# EAGLE design ESP32_modul (EAGLE 9.3.0)
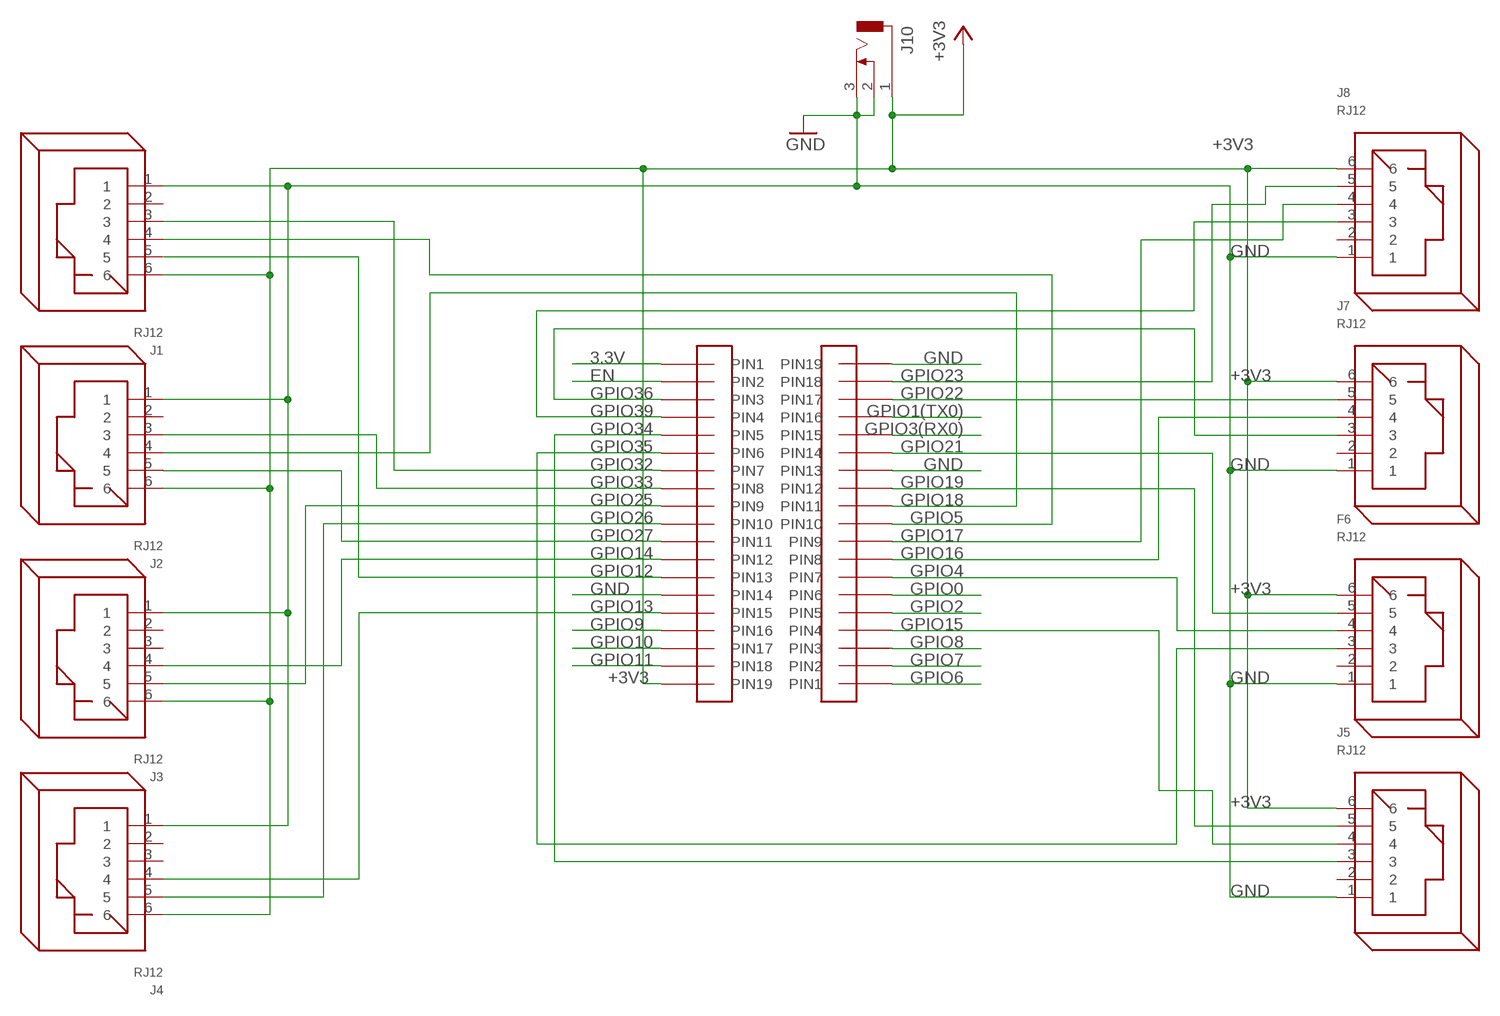
[diagram p0: schematic, sheet 1]

## Parts
F6  RJ12  [RJ12]
J1  RJ12  [RJ12]
J2  RJ12  [RJ12]
J3  RJ12  [RJ12]
J4  RJ12  [RJ12]
J5  RJ12  [RJ12]
J7  RJ12  [RJ12]
J8  RJ12  [RJ12]
J10  DCJ0303  [DCJ0303]
U$1  F-1X19  [F-1X19]
U$2  F-1X19  [F-1X19]

## Nets
3.3V: U$1.P$1(PIN1)
+3V3: F6.6 J1.6 J2.6 J3.6 J4.6 J5.6 J7.6 J8.6 J10.1 U$1.P$19(PIN19)
EN: U$1.P$2(PIN2)
GND: F6.1 J1.1 J2.1 J3.1 J4.1 J5.1 J7.1 J8.1 J10.2 J10.3 U$1.P$14(PIN14) U$2.P$13(PIN13) U$2.P$19(PIN19)
GPIO0: U$2.P$6(PIN6)
GPIO1(TX0): U$2.P$16(PIN16)
GPIO2: U$2.P$5(PIN5)
GPIO3(RX0): U$2.P$15(PIN15)
GPIO4: F6.4 U$2.P$7(PIN7)
GPIO5: J1.4 U$2.P$10(PIN10)
GPIO6: U$2.P$1(PIN1)
GPIO7: U$2.P$2(PIN2)
GPIO8: U$2.P$3(PIN3)
GPIO9: U$1.P$16(PIN16)
GPIO10: U$1.P$17(PIN17)
GPIO11: U$1.P$18(PIN18)
GPIO12: J1.5 U$1.P$13(PIN13)
GPIO13: J4.4 U$1.P$15(PIN15)
GPIO14: J3.4 U$1.P$12(PIN12)
GPIO15: J5.4 U$2.P$4(PIN4)
GPIO16: J7.4 U$2.P$8(PIN8)
GPIO17: J8.4 U$2.P$9(PIN9)
GPIO18: J2.4 U$2.P$11(PIN11)
GPIO19: J5.5 U$2.P$12(PIN12)
GPIO21: F6.5 U$2.P$14(PIN14)
GPIO22: J7.5 U$2.P$17(PIN17)
GPIO23: J8.5 U$2.P$18(PIN18)
GPIO25: J3.5 U$1.P$9(PIN9)
GPIO26: J4.5 U$1.P$10(PIN10)
GPIO27: J2.5 U$1.P$11(PIN11)
GPIO32: J1.3 U$1.P$7(PIN7)
GPIO33: J2.3 U$1.P$8(PIN8)
GPIO34: J5.3 U$1.P$5(PIN5)
GPIO35: F6.3 U$1.P$6(PIN6)
GPIO36: J7.3 U$1.P$3(PIN3)
GPIO39: J8.3 U$1.P$4(PIN4)
Unconnected: F6.2 J1.2 J2.2 J3.2 J3.3 J4.2 J4.3 J5.2 J7.2 J8.2

## Library data of the parts
F6 J1-J5 J7 J8 = con-rj:RJ12: RJ12, RJ14 and RJ25 RJ12, RJ14 and RJ25 jacks side mounted http://www.tycoelectronics.com
J10 = con-jack:DCJ0303: DC POWER JACK Source: DCJ0303.pdf; OC_FARNELL: unknown; OC_NEWARK: unknown
U$1 U$2 = F_1X19:F-1X19

## Board
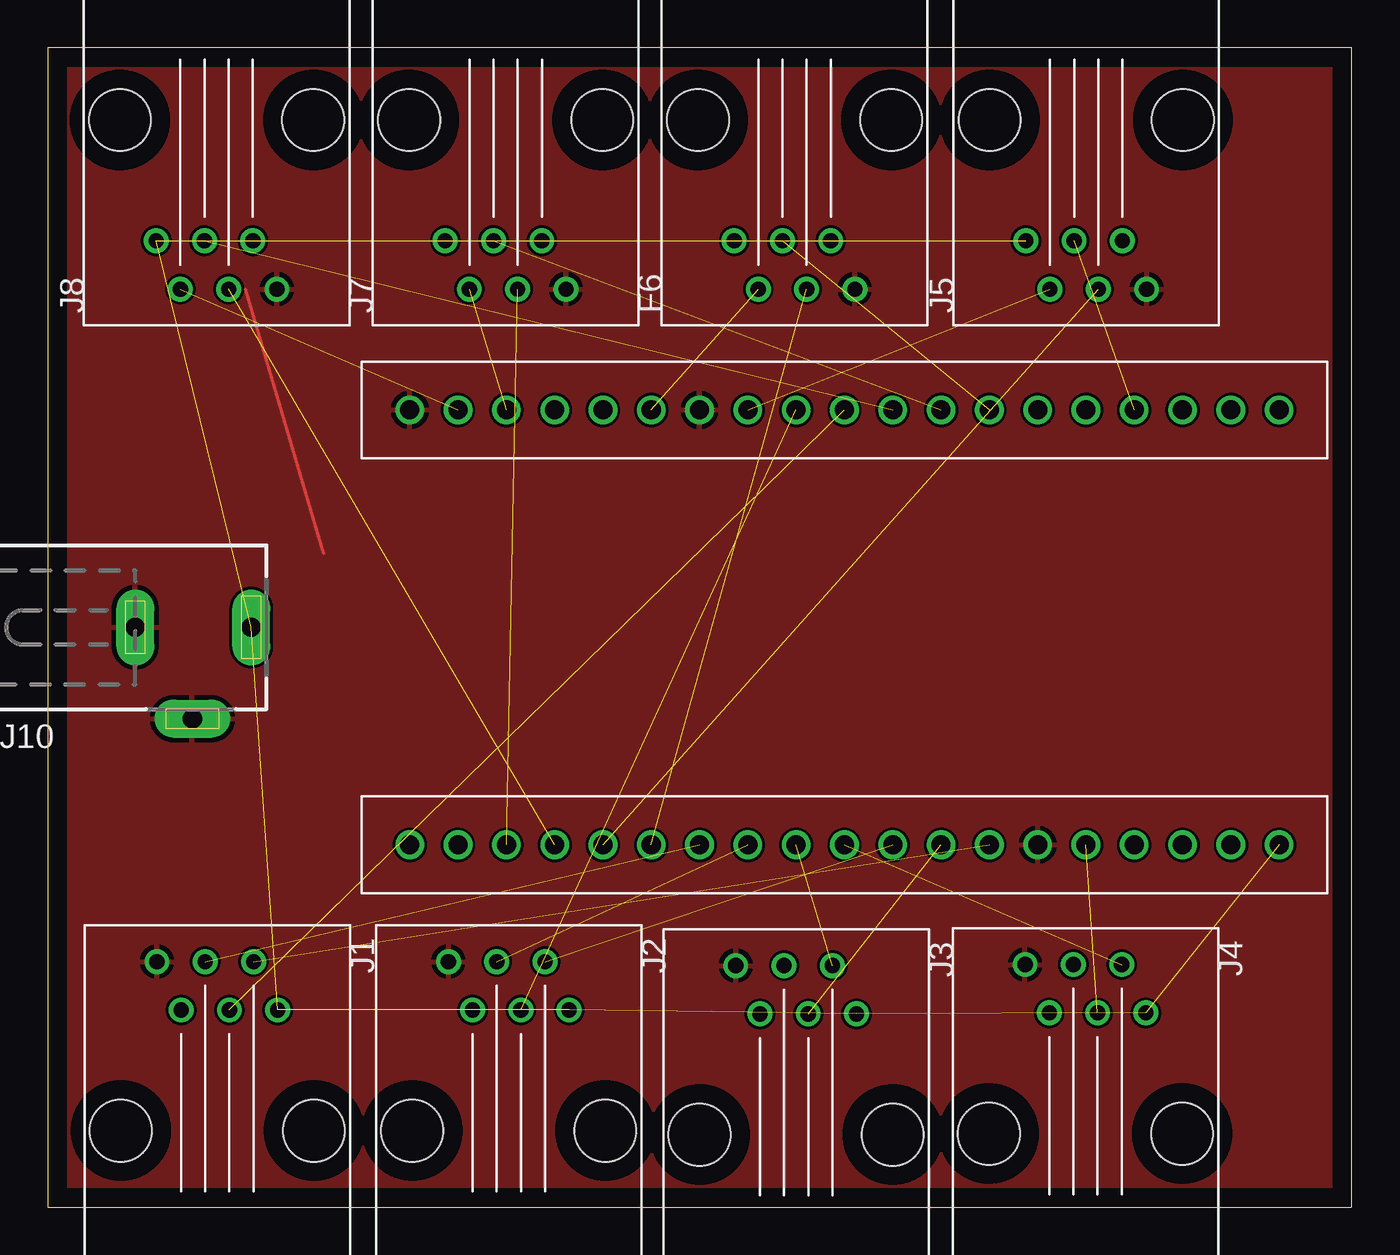
[diagram p1: board, top side]

Size 68.6 x 60.96 mm. Coordinates in mm from the lower left corner, seen from the top.
Outline: 0,0 68.56,0 68.58,0.02 68.6,12.7 68.58,60.96 0,60.96 0,0
Copper layers (1*16): Top 0.035mm / dielectric 1.5mm / Bottom 0.035mm
Design rules "default": minimum track width 6mil, minimum drill 0.35mm, track to track 6mil, track to pad 6mil, pad to pad 6mil, via to via 6mil, smd to smd 6mil, copper to edge 40mil, drill to drill 6mil, minimum pad ring 10mil, minimum via ring 8mil, stop-mask expansion 4mil, vias tented up to drill 0mil, thermal gap 10mil

### Footprints (pad centres in the part's own frame; a part is rotated, then mirrored left to right if it is on the bottom)
RJ12 = drill 0.8: 1 -8.89,-3.175; 2 -6.35,-1.905; 3 -8.89,-0.635; 4 -6.35,0.635; 5 -8.89,1.905; 6 -6.35,3.175 | hole 3.25: 0,-5.08; 0,5.08
DCJ0303 = drill 1 pad 2 long: 1 0,3.1; 2 4.8,0; 3 0,-3
F-1X19 = drill 1: P$1 -2.54,7.62; P$2 -2.54,5.08; P$3 -2.54,2.54; P$4 -2.54,0; P$5 -2.54,-2.54; P$6 -2.54,-5.08; P$7 -2.54,-7.62; P$8 -2.54,-10.16; P$9 -2.54,-12.7; P$10 -2.54,-15.24; P$11 -2.54,-17.78; P$12 -2.54,-20.32; P$13 -2.54,-22.86; P$14 -2.54,-25.4; P$15 -2.54,-27.94; P$16 -2.54,-30.48; P$17 -2.54,-33.02; P$18 -2.54,-35.56; P$19 -2.54,-38.1

### Placement (x,y rotation side)
F6  39.28,57.15 90 top
J1  8.93,4.02 270 top
J2  24.26,4.02 270 top
J3  39.37,3.81 270 top
J4  54.59,3.86 270 top
J5  54.62,57.15 90 top
J7  24.09,57.15 90 top
J8  8.89,57.15 90 top
J10  7.62,30.48 270 top
U$1  26.67,21.59 90 top
U$2  57.15,39.37 270 top

### Tracks (layer width: path | path; a pad name or v marks a point on that pad's centre or on a via)
+3V3  (9 unrouted)
GND
  Top 0.152: 14.53,34.37 10.41,48.26
  pour Top: 0,60.96 68.58,60.96 68.58,0 0,0
GPIO4  (1 unrouted)
GPIO5  (1 unrouted)
GPIO12  (1 unrouted)
GPIO13  (1 unrouted)
GPIO14  (1 unrouted)
GPIO15  (1 unrouted)
GPIO16  (1 unrouted)
GPIO17  (1 unrouted)
GPIO18  (1 unrouted)
GPIO19  (1 unrouted)
GPIO21  (1 unrouted)
GPIO22  (1 unrouted)
GPIO23  (1 unrouted)
GPIO25  (1 unrouted)
GPIO26  (1 unrouted)
GPIO27  (1 unrouted)
GPIO32  (1 unrouted)
GPIO33  (1 unrouted)
GPIO34  (1 unrouted)
GPIO35  (1 unrouted)
GPIO36  (1 unrouted)
GPIO39  (1 unrouted)